# EAGLE design ESP_SensorThing (EAGLE 8.0.1)
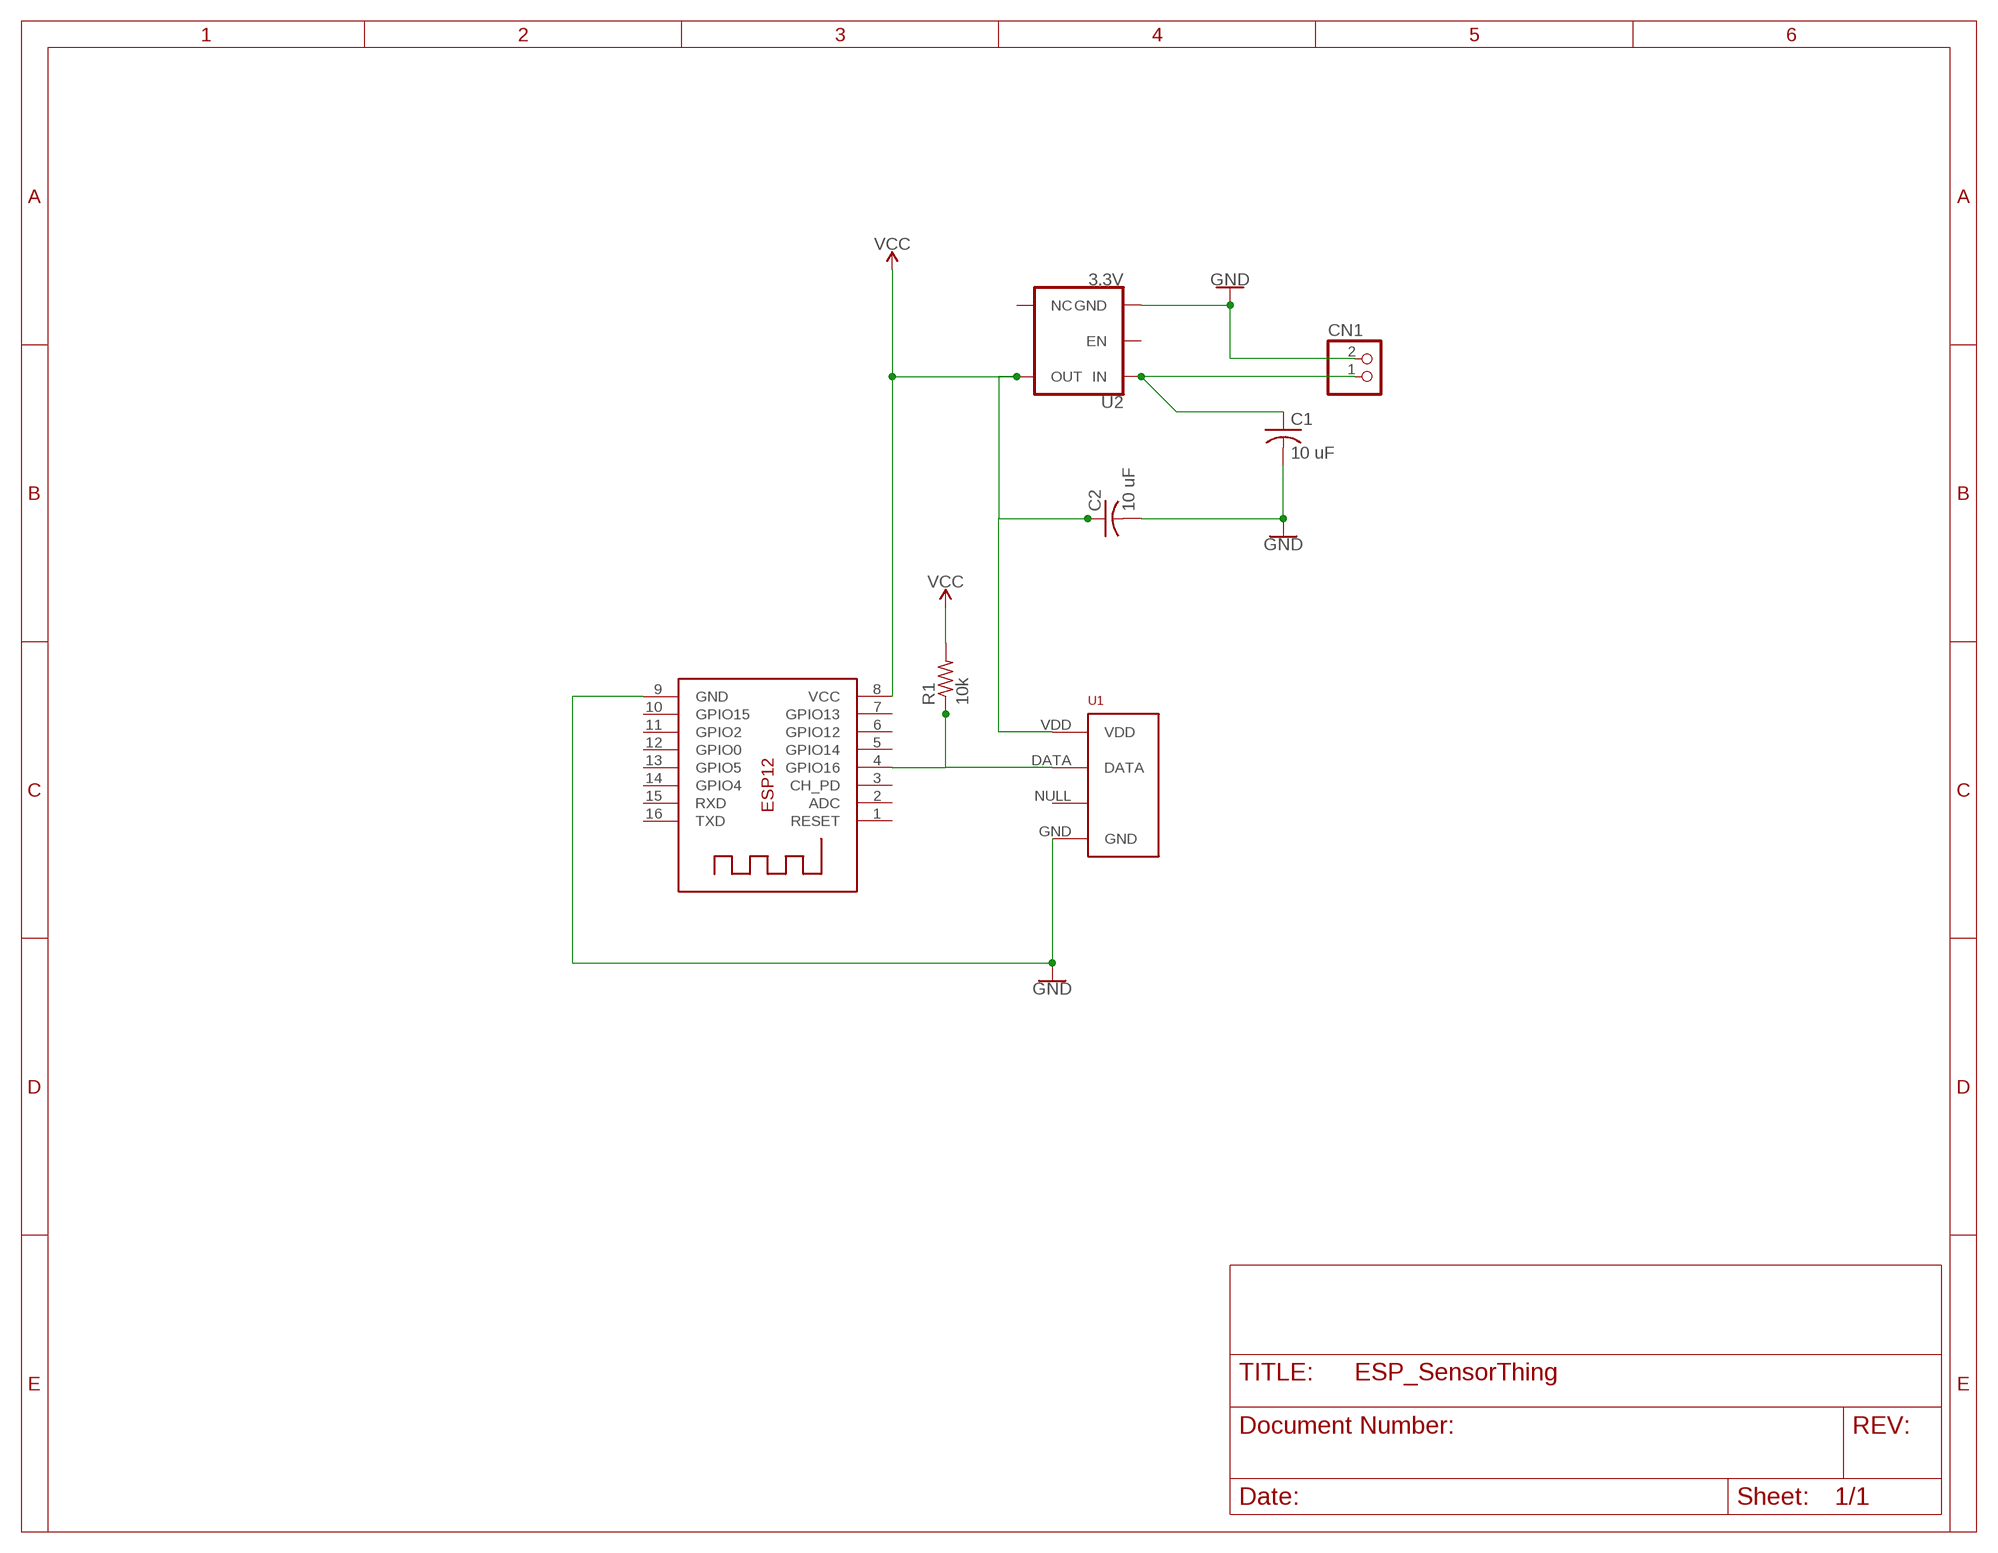
[diagram p0: schematic, sheet 1]

## Parts
C1  10 uF  C-USC1210  [C1210]
C2  10 uF  C-USC1210  [C1210]
CN1  JST_2PIN-SMT-RA  [JST-PH-2-SMT-RA]
R1  10k  R-US_R0805  [R0805]
U1  RHT03_DHT-22_AM2302RA  [RHT03_DHT-22/RA]
U2  3.3V  V_REG_AP2112K-3.3V  [SOT23-5]
X1  ESP-12  [ESP-12]

## Nets
BATT: C1.1 CN1.1 U2.1(IN)
DATA: R1.1 U1.DATA X1.4(GPIO16)
GND: C1.2 C2.2 CN1.2 U1.GND U2.2(GND) X1.9(GND)
VCC: C2.1 R1.2 U1.VDD U2.5(OUT) X1.8(VCC)
Unconnected: U1.NULL U2.3(EN) U2.4(NC) X1.1(RESET) X1.2(ADC) X1.3(CH_PD) X1.5(GPIO14) X1.6(GPIO12) X1.7(GPIO13) X1.10(GPIO15) X1.11(GPIO2) X1.12(GPIO0) X1.13(GPIO5) X1.14(GPIO4) X1.15(RXD) X1.16(TXD)

## Library data of the parts
C1 C2 = adafruit:C-US: CAPACITOR, American symbol
CN1 = adafruit:JST_2PIN: JST 2-Pin Connectors of various flavors SMT-RA (S2B-PH-SM4) 4UConnector #17311 SMT (B2B-PH-SM4) THM-RA (S2B-PH) THM (B2B-PH)
R1 = resistor:R-US_: RESISTOR, American symbol
U1 = RHT03_DHT-22_AM2302:RHT03_DHT-22_AM2302: RHT03 / DHT-22 / AM2302 Packages and symbol for the RHT03 / DHT-22 relative humidity and temperature sensor. Note: The AM2302 is a wired version of the DHT-22 which typically requires less clearance and is thus provided as a separate package.; PROD_ID: SEN-10167
U2 = SparkFun-IC-Power:V_REG_AP2112: AP2112 - 600mA CMOS LDO Regulator w/ Enable The AP2112 is CMOS process low dropout linear regulator with enable function, the regulator delivers a guaranteed 600mA (min.) continuous load current. Features Output Voltage Accuracy: ±1.5% Output Current: 600mA (Min.) Foldback Short Current Protection: 50mA Enable Function to Turn ON/OFF VOUT Low Dropout Voltage (3.3V): 250mV (Typ.) @IOUT=600mA Excellent Load Regulation: 0.2%/A (Typ.) Excellent Line Regulation: 0.02%/V (Typ.) Low Quiescent Current: 55μA (Typ.) Low Standby Current: 0.01μA (Typ.) Low Output Noise: 50μVRMS PSRR: 100Hz -65dB, 1kHz -65dB OTSD Protection Stable with 1.0μF Flexible Cap: Ceramic, Tantalum and Aluminum Electrolytic Operation Temperature Range: -40°C to 85°C ESD: MM 400V, HBM 4000V; PROD_ID: VREG-12457
X1 = adafruit:ESP-12

## Board
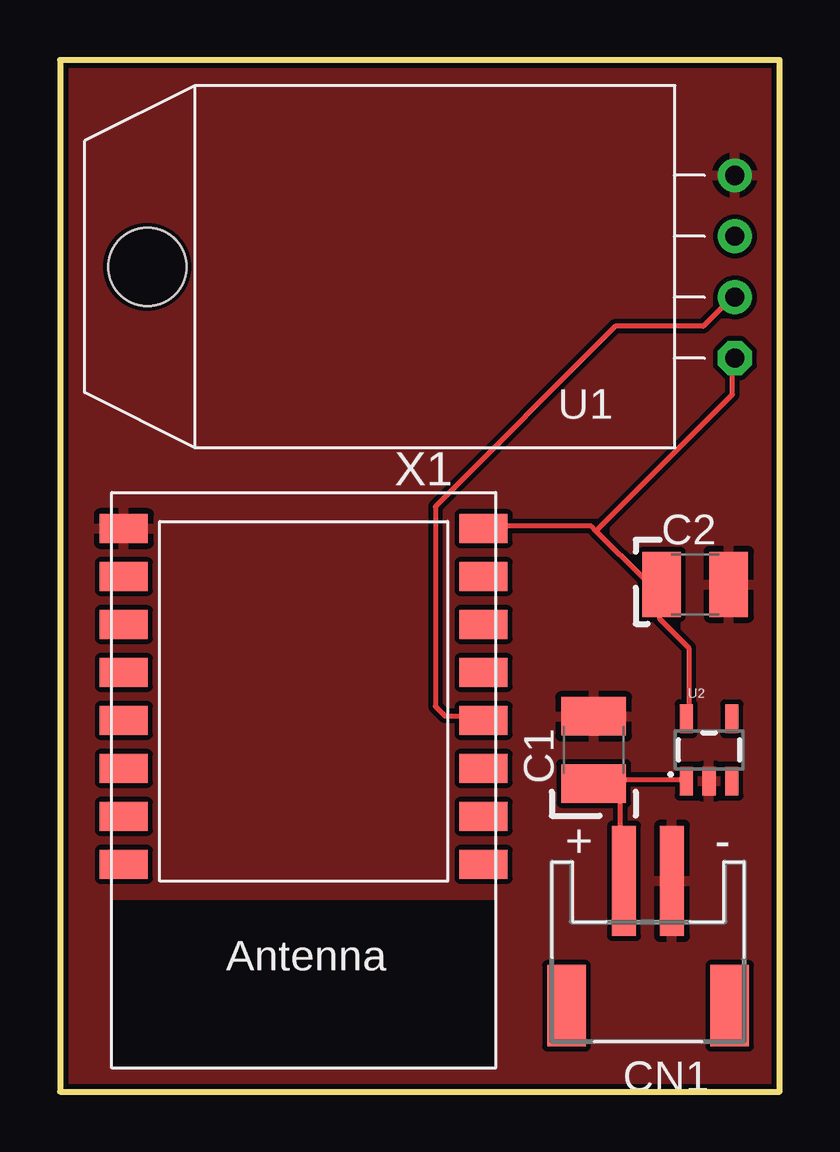
[diagram p1: board, top side]
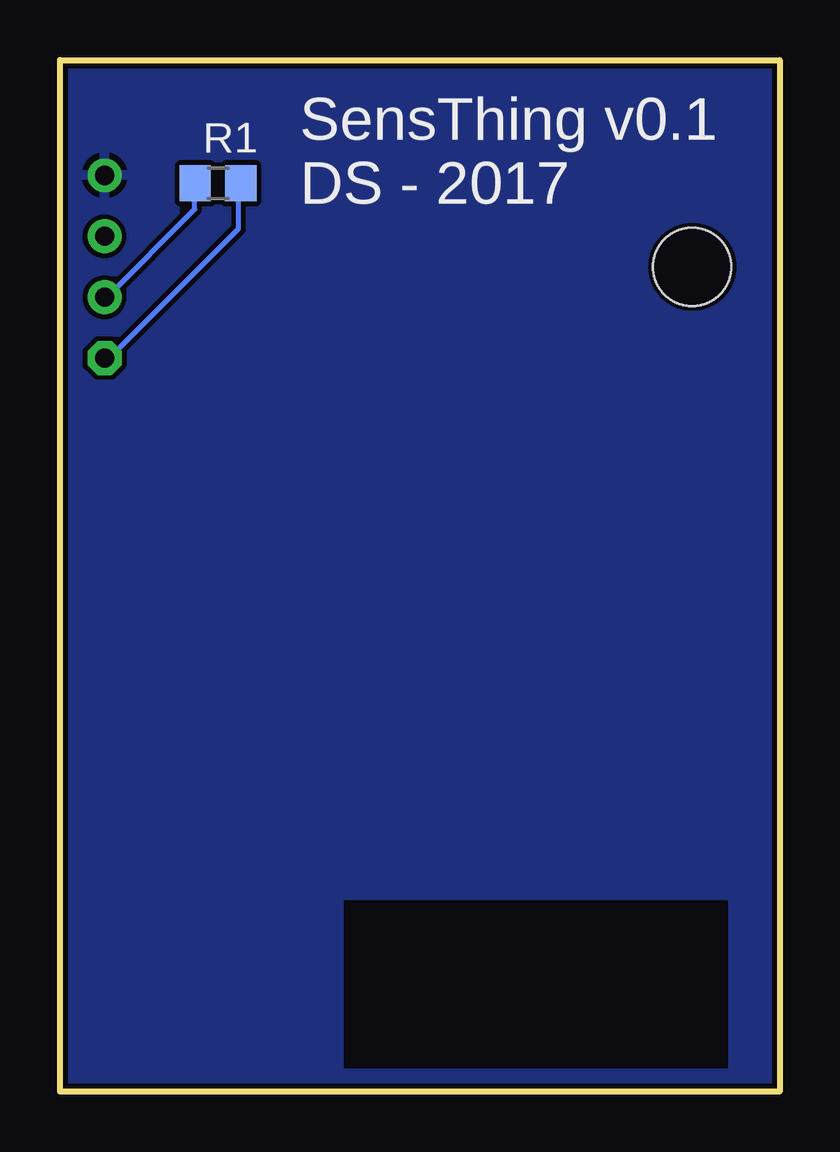
[diagram p2: board, bottom side, seen from below]

Size 30 x 43 mm. Coordinates in mm from the lower left corner, seen from the top.
Outline: 0,0 30,0 30,43 0,43 0,0
Copper layers (1*16): Top 0.035mm / dielectric 1.5mm / Bottom 0.035mm
Design rules "SparkFun": minimum track width 8mil, minimum drill 20mil, track to track 8mil, track to pad 8mil, pad to pad 8mil, via to via 8mil, smd to smd 8mil, copper to edge 8mil, drill to drill 8mil, minimum pad ring 12mil, minimum via ring 10mil, stop-mask expansion 4mil, vias tented up to drill 20mil, thermal gap 10mil

### Footprints (pad centres in the part's own frame; a part is rotated, then mirrored left to right if it is on the bottom)
C1210 = smd 1.6 x 2.7: 1 -1.4,0; 2 1.4,0
JST-PH-2-SMT-RA = smd 1 x 4.6: 1 1,-3.7; 2 -1,-3.7 | smd 1.6 x 3.4: NC1 -3.4,1.5; NC2 3.4,1.5
R0805 = smd 1.3 x 1.5: 1 -0.95,0; 2 0.95,0
RHT03_DHT-22/RA = drill 0.8: DATA -1.27,0; GND 3.81,0; NULL 1.27,0 | drill 0.8 octagon: VDD -3.81,0 | hole 3.25: 0,24.5
SOT23-5 = smd 0.55 x 1.2: 1 -0.95,-1.3; 2 0,-1.3; 3 0.95,-1.3; 4 0.95,1.3; 5 -0.95,1.3
ESP-12 = smd 2 x 1.2: 1 -7.5,4.5; 2 -7.5,2.5; 3 -7.5,0.5; 4 -7.5,-1.5; 5 -7.5,-3.5; 6 -7.5,-5.5; 7 -7.5,-7.5; 8 -7.5,-9.5; 9 7.5,-9.5; 10 7.5,-7.5; 11 7.5,-5.5; 12 7.5,-3.5; 13 7.5,-1.5; 14 7.5,0.5; 15 7.5,2.5; 16 7.5,4.5

### Placement (x,y rotation side)
C1  22.25,14.24 90 top
C2  26.48,21.14 0 top
CN1  24.52,5.08 180 top
R1  23.41,37.86 0 bottom
U1  28.14,34.38 90 top
U2  27.06,14.24 0 top
X1  10.16,13.97 180 top

### Tracks (layer width: path | path; a pad name or v marks a point on that pad's centre or on a via)
BATT
  Top 0.203: 23.37,13.01 22.35,13.01 C1.1 23.37,13.01 | 23.37,13.01 26.01,13.01 U2.1 | 23.37,13.01 23.37,8.94 CN1.1
DATA
  Top 0.203: X1.4 17.48,15.65 16.05,15.65 15.65,16.05 15.65,24.38 23.16,31.9 26.82,31.9 28.04,33.12 U1.DATA
  Bottom 0.203: R1.1 24.38,37.8 24.38,36.78 28.04,33.12 U1.DATA
GND
  pour Top: 0,43 30,43 30,0 0,0
  pour Bottom: 0,0 30,0 30,43 0,43
VCC
  Top 0.203: U2.5 26.21,15.65 26.21,18.49 24.99,19.71 24.99,21.13 C2.1 24.99,21.34 24.38,21.34 22.35,23.37 | 22.35,23.37 22.15,23.57 17.68,23.57 X1.8 | 22.35,23.37 28.04,29.06 28.04,30.48 U1.VDD
  Bottom 0.203: R1.2 22.55,37.8 22.55,35.97 28.04,30.48 U1.VDD

### Text on the board
bPlace: SensThing v0.1 / DS - 2017